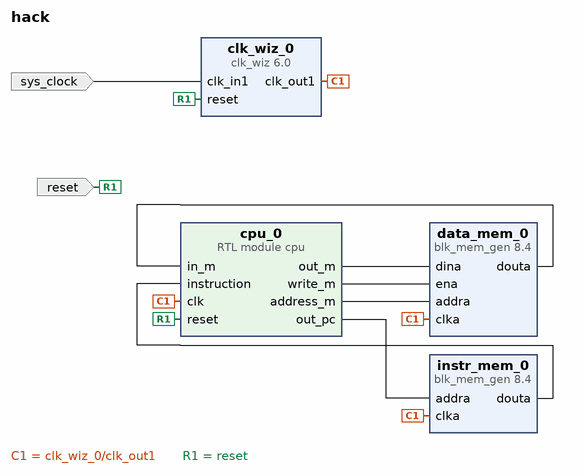
[diagram p0: block diagram of the top level]
# Vivado block design hack, xc7a35ticsg324-1L, Vivado 2020.1
create_bd_design hack

create_bd_port -dir I -type clk sys_clock
set_property -dict {CONFIG.FREQ_HZ 100000000 CONFIG.PHASE 0.000} [get_bd_ports sys_clock]
create_bd_port -dir I -type rst reset
set_property -dict {CONFIG.POLARITY ACTIVE_LOW} [get_bd_ports reset]

create_bd_cell -type ip -vlnv xilinx.com:ip:blk_mem_gen:8.4 instr_mem_0
set_property -dict [list \
  CONFIG.Enable_32bit_Address false \
  CONFIG.Enable_A Always_Enabled \
  CONFIG.Memory_Type Single_Port_ROM \
  CONFIG.Port_A_Write_Rate 0 \
  CONFIG.Register_PortA_Output_of_Memory_Primitives true \
  CONFIG.Use_RSTA_Pin false \
  CONFIG.Write_Depth_A 32768 \
  CONFIG.Write_Width_A 16 \
  CONFIG.use_bram_block Stand_Alone \
] [get_bd_cells instr_mem_0]
create_bd_cell -type ip -vlnv xilinx.com:ip:blk_mem_gen:8.4 data_mem_0
set_property -dict [list \
  CONFIG.Enable_32bit_Address false \
  CONFIG.Read_Width_A 16 \
  CONFIG.Register_PortA_Output_of_Memory_Primitives true \
  CONFIG.Use_Byte_Write_Enable false \
  CONFIG.Use_RSTA_Pin false \
  CONFIG.Write_Depth_A 32768 \
  CONFIG.Write_Width_A 16 \
  CONFIG.use_bram_block Stand_Alone \
] [get_bd_cells data_mem_0]
create_bd_cell -type ip -vlnv xilinx.com:ip:clk_wiz:6.0 clk_wiz_0
set_property -dict [list \
  CONFIG.CLK_IN1_BOARD_INTERFACE sys_clock \
  CONFIG.RESET_BOARD_INTERFACE reset \
  CONFIG.USE_BOARD_FLOW true \
] [get_bd_cells clk_wiz_0]
create_bd_cell -type module -reference cpu cpu_0

# ---- connections ----

connect_bd_net -net blk_mem_gen_0_douta [get_bd_pins instr_mem_0/douta] [get_bd_pins cpu_0/instruction]
connect_bd_net [get_bd_pins cpu_0/out_pc] [get_bd_pins instr_mem_0/addra]
connect_bd_net -net blk_mem_gen_1_douta [get_bd_pins data_mem_0/douta] [get_bd_pins cpu_0/in_m]
connect_bd_net [get_bd_pins cpu_0/out_m] [get_bd_pins data_mem_0/dina]
connect_bd_net [get_bd_pins cpu_0/write_m] [get_bd_pins data_mem_0/ena]
connect_bd_net [get_bd_pins cpu_0/address_m] [get_bd_pins data_mem_0/addra]
connect_bd_net -net clk_wiz_clk_out1 [get_bd_pins clk_wiz_0/clk_out1] \
  [get_bd_pins data_mem_0/clka] [get_bd_pins instr_mem_0/clka] [get_bd_pins cpu_0/clk]
connect_bd_net [get_bd_ports sys_clock] [get_bd_pins clk_wiz_0/clk_in1]
connect_bd_net [get_bd_ports reset] [get_bd_pins clk_wiz_0/reset] [get_bd_pins cpu_0/reset]

validate_bd_design
save_bd_design
